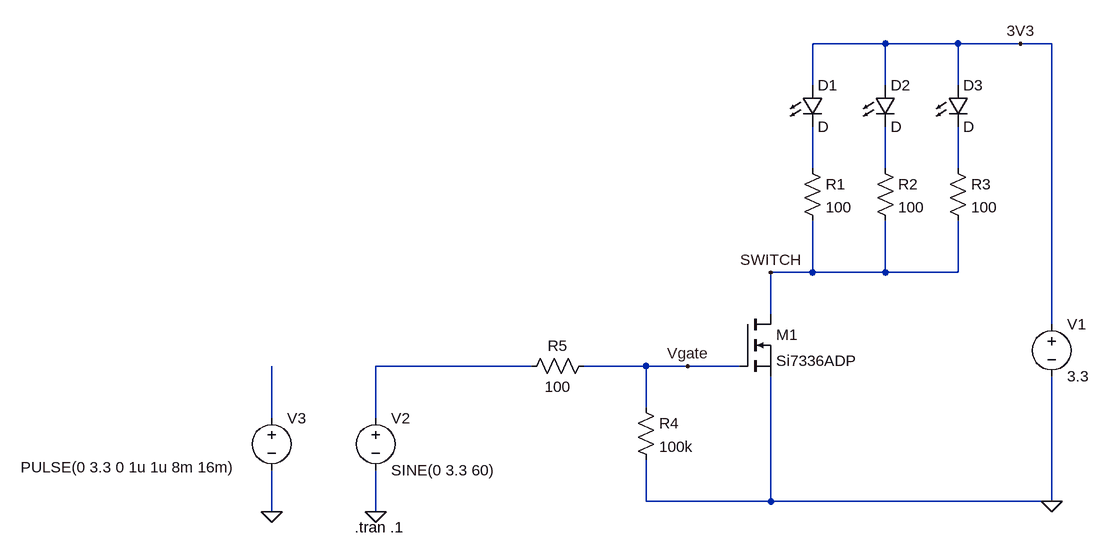
[diagram p0: schematic ltspice_backlight_driver_WEST.asc]
ltspice_backlight_driver_WEST.asc, the LTspice schematic file:
Version 4.1
SHEET 1 880 680
WIRE 384 -320 272 -320
WIRE 496 -320 384 -320
WIRE 592 -320 496 -320
WIRE 640 -320 592 -320
WIRE 272 -256 272 -320
WIRE 384 -256 384 -320
WIRE 496 -256 496 -320
WIRE 272 -128 272 -192
WIRE 384 -128 384 -192
WIRE 496 -128 496 -192
WIRE 272 32 272 -48
WIRE 272 32 208 32
WIRE 384 32 384 -48
WIRE 384 32 272 32
WIRE 496 32 496 -48
WIRE 496 32 384 32
WIRE 208 96 208 32
WIRE 640 112 640 -320
WIRE -160 176 -400 176
WIRE 16 176 -80 176
WIRE 80 176 16 176
WIRE 160 176 80 176
WIRE 16 240 16 176
WIRE -560 256 -560 176
WIRE -400 256 -400 176
WIRE 16 384 16 320
WIRE 208 384 208 192
WIRE 208 384 16 384
WIRE 640 384 640 192
WIRE 640 384 208 384
WIRE -560 400 -560 336
WIRE -400 400 -400 336
FLAG 592 -320 3V3
FLAG 208 32 SWITCH
FLAG -400 400 0
FLAG 640 384 0
FLAG -560 400 0
FLAG 80 176 Vgate
SYMBOL nmos 160 96 R0
SYMATTR InstName M1
SYMATTR Value Si7336ADP
SYMBOL LED 368 -256 R0
SYMATTR InstName D2
SYMBOL LED 256 -256 R0
SYMATTR InstName D1
SYMBOL LED 480 -256 R0
SYMATTR InstName D3
SYMBOL res 480 -144 R0
SYMATTR InstName R3
SYMATTR Value 100
SYMBOL res 256 -144 R0
SYMATTR InstName R1
SYMATTR Value 100
SYMBOL res 368 -144 R0
SYMATTR InstName R2
SYMATTR Value 100
SYMBOL voltage 640 96 R0
WINDOW 123 0 0 Left 0
WINDOW 39 0 0 Left 0
SYMATTR InstName V1
SYMATTR Value 3.3
SYMBOL res 0 224 R0
SYMATTR InstName R4
SYMATTR Value 100k
SYMBOL res -64 160 R90
WINDOW 0 0 56 VBottom 2
WINDOW 3 32 56 VTop 2
SYMATTR InstName R5
SYMATTR Value 100
SYMBOL voltage -400 240 R0
WINDOW 123 0 0 Left 0
WINDOW 39 0 0 Left 0
SYMATTR InstName V2
SYMATTR Value SINE(0 3.3 60)
SYMBOL voltage -560 240 R0
WINDOW 3 -386 92 Left 2
WINDOW 123 0 0 Left 0
WINDOW 39 0 0 Left 0
SYMATTR Value PULSE(0 3.3 0 1u 1u 8m 16m)
SYMATTR InstName V3
TEXT -432 424 Left 2 !.tran .1

The netlist it stands for:
* ltspice_backlight_driver_WEST.asc
M1 SWITCH Vgate 0 0 Si7336ADP
D2 3V3 N002 D
D1 3V3 N001 D
D3 3V3 N003 D
R3 N003 SWITCH 100
R1 N001 SWITCH 100
R2 N002 SWITCH 100
V1 3V3 0 3.3
R4 Vgate 0 100k
R5 Vgate N004 100
V2 N004 0 SINE(0 3.3 60)
V3 N005 0 PULSE(0 3.3 0 1u 1u 8m 16m)
.model D D
.lib standard.dio
.model NMOS NMOS
.model PMOS PMOS
.lib standard.mos
.tran .1
.backanno
.end